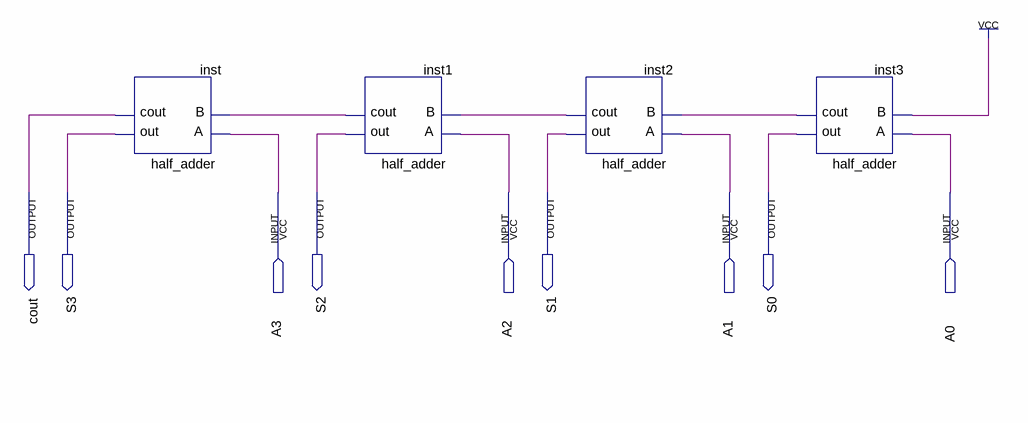
[diagram p0: schematic sheet]
// Quartus schematic binary_incrementer_4bit.bdf as structural Verilog: 4 symbols, 9 pins
module binary_incrementer_4bit (
  input  A3,
  input  A2,
  input  A1,
  input  A0,
  output cout,
  output S3,
  output S2,
  output S1,
  output S0
);

  wire inst1_cout, inst2_cout, inst3_cout;

  half_adder inst (.A(A3), .B(inst1_cout), .out(S3), .cout(cout));
  half_adder inst1 (.A(A2), .B(inst2_cout), .out(S2), .cout(inst1_cout));
  half_adder inst2 (.A(A1), .B(inst3_cout), .out(S1), .cout(inst2_cout));
  half_adder inst3 (.A(A0), .B(1'b1), .out(S0), .cout(inst3_cout));
endmodule
